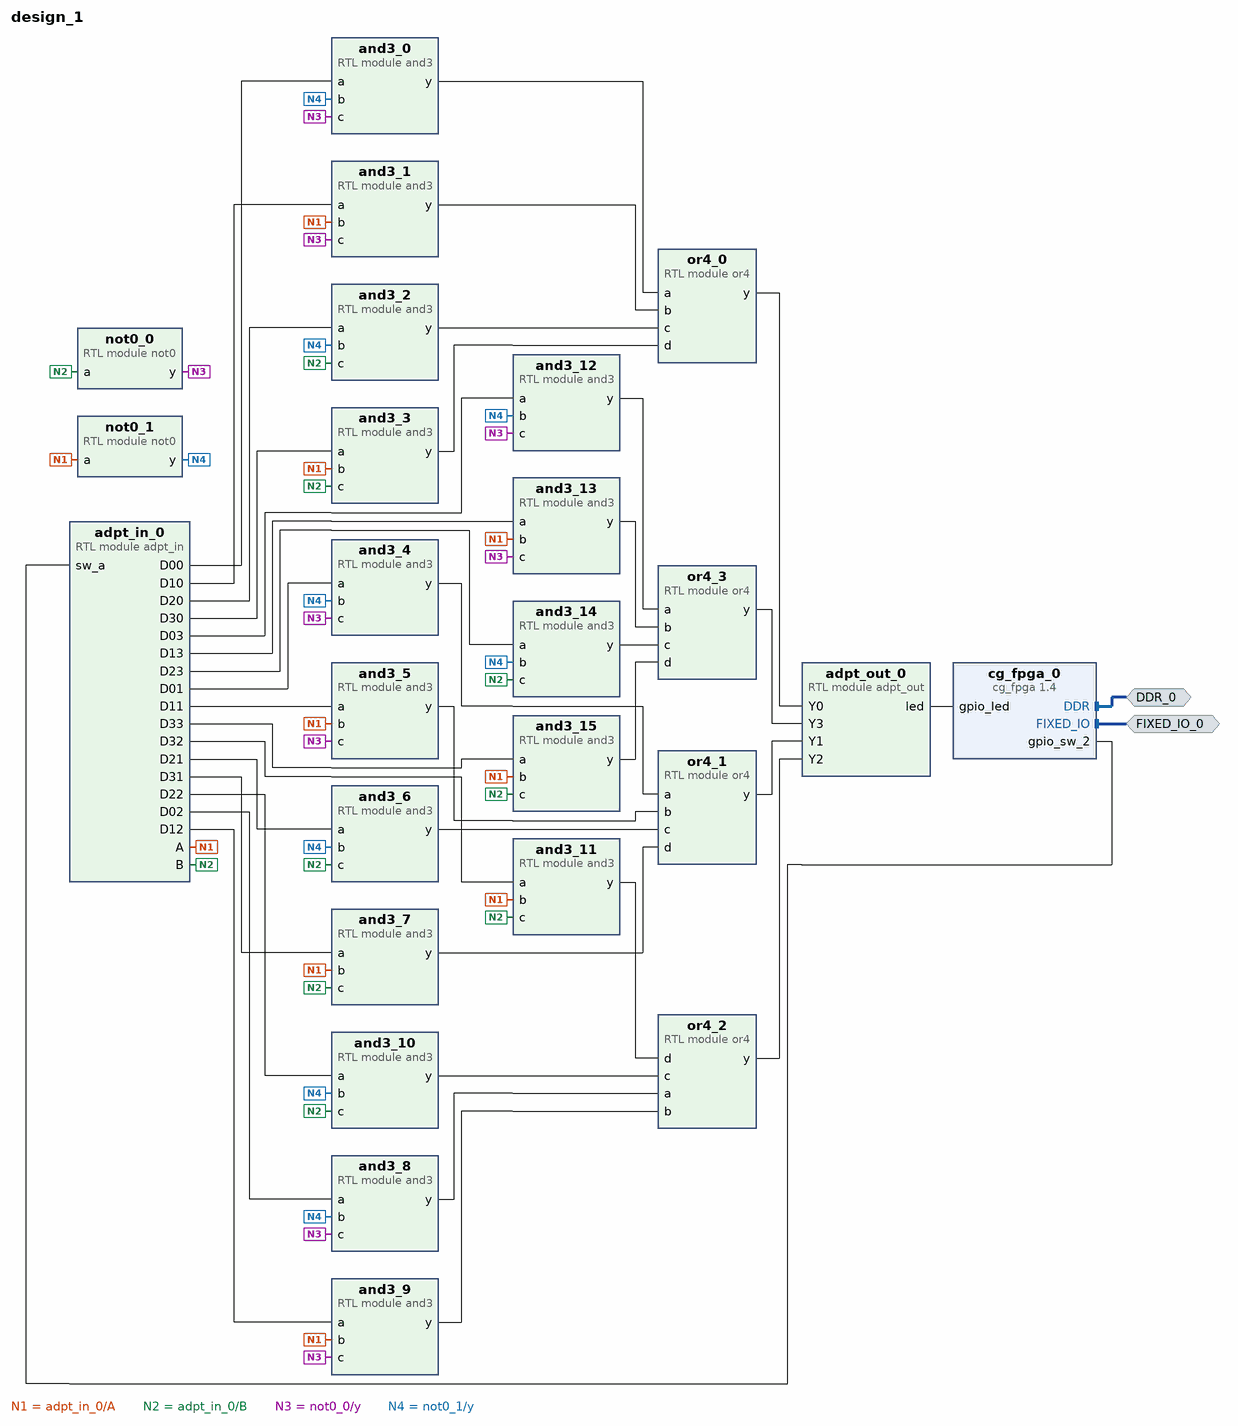
[diagram p0: block diagram of the top level]
# Vivado block design design_1, xc7z020clg400-1, Vivado 2024.2
create_bd_design design_1

create_bd_intf_port -mode Master -vlnv xilinx.com:display_processing_system7:fixedio_rtl:1.0 FIXED_IO_0
create_bd_intf_port -mode Master -vlnv xilinx.com:interface:ddrx_rtl:1.0 DDR_0

create_bd_cell -type ip -vlnv educg.net:user:cg_fpga:1.4 cg_fpga_0
create_bd_cell -type module -reference adpt_in adpt_in_0
create_bd_cell -type module -reference adpt_out adpt_out_0
create_bd_cell -type module -reference not0 not0_0
create_bd_cell -type module -reference and3 and3_0
create_bd_cell -type module -reference not0 not0_1
create_bd_cell -type module -reference and3 and3_1
create_bd_cell -type module -reference or4 or4_0
create_bd_cell -type module -reference and3 and3_2
create_bd_cell -type module -reference and3 and3_3
create_bd_cell -type module -reference and3 and3_4
create_bd_cell -type module -reference and3 and3_5
create_bd_cell -type module -reference and3 and3_6
create_bd_cell -type module -reference and3 and3_7
create_bd_cell -type module -reference or4 or4_1
create_bd_cell -type module -reference or4 or4_2
create_bd_cell -type module -reference and3 and3_8
create_bd_cell -type module -reference and3 and3_9
create_bd_cell -type module -reference and3 and3_10
create_bd_cell -type module -reference and3 and3_11
create_bd_cell -type module -reference or4 or4_3
create_bd_cell -type module -reference and3 and3_12
create_bd_cell -type module -reference and3 and3_13
create_bd_cell -type module -reference and3 and3_14
create_bd_cell -type module -reference and3 and3_15

# ---- connections ----

connect_bd_intf_net [get_bd_intf_ports DDR_0] [get_bd_intf_pins cg_fpga_0/DDR]
connect_bd_intf_net [get_bd_intf_ports FIXED_IO_0] [get_bd_intf_pins cg_fpga_0/FIXED_IO]
connect_bd_net [get_bd_pins adpt_in_0/A] \
  [get_bd_pins not0_1/a] [get_bd_pins and3_1/b] [get_bd_pins and3_3/b] [get_bd_pins and3_5/b] [get_bd_pins and3_7/b] \
  [get_bd_pins and3_9/b] [get_bd_pins and3_11/b] [get_bd_pins and3_13/b] [get_bd_pins and3_15/b]
connect_bd_net [get_bd_pins adpt_in_0/B] \
  [get_bd_pins not0_0/a] [get_bd_pins and3_2/c] [get_bd_pins and3_3/c] [get_bd_pins and3_6/c] [get_bd_pins and3_7/c] \
  [get_bd_pins and3_10/c] [get_bd_pins and3_11/c] [get_bd_pins and3_14/c] [get_bd_pins and3_15/c]
connect_bd_net [get_bd_pins adpt_in_0/D00] [get_bd_pins and3_0/a]
connect_bd_net [get_bd_pins adpt_in_0/D01] [get_bd_pins and3_4/a]
connect_bd_net [get_bd_pins adpt_in_0/D02] [get_bd_pins and3_8/a]
connect_bd_net [get_bd_pins adpt_in_0/D03] [get_bd_pins and3_12/a]
connect_bd_net [get_bd_pins adpt_in_0/D10] [get_bd_pins and3_1/a]
connect_bd_net [get_bd_pins adpt_in_0/D11] [get_bd_pins and3_5/a]
connect_bd_net [get_bd_pins adpt_in_0/D12] [get_bd_pins and3_9/a]
connect_bd_net [get_bd_pins adpt_in_0/D13] [get_bd_pins and3_13/a]
connect_bd_net [get_bd_pins adpt_in_0/D20] [get_bd_pins and3_2/a]
connect_bd_net [get_bd_pins adpt_in_0/D21] [get_bd_pins and3_6/a]
connect_bd_net [get_bd_pins adpt_in_0/D22] [get_bd_pins and3_10/a]
connect_bd_net [get_bd_pins adpt_in_0/D23] [get_bd_pins and3_14/a]
connect_bd_net [get_bd_pins adpt_in_0/D30] [get_bd_pins and3_3/a]
connect_bd_net [get_bd_pins adpt_in_0/D31] [get_bd_pins and3_7/a]
connect_bd_net [get_bd_pins adpt_in_0/D32] [get_bd_pins and3_11/a]
connect_bd_net [get_bd_pins adpt_in_0/D33] [get_bd_pins and3_15/a]
connect_bd_net [get_bd_pins adpt_out_0/led] [get_bd_pins cg_fpga_0/gpio_led]
connect_bd_net [get_bd_pins and3_0/y] [get_bd_pins or4_0/a]
connect_bd_net [get_bd_pins and3_10/y] [get_bd_pins or4_2/c]
connect_bd_net [get_bd_pins and3_11/y] [get_bd_pins or4_2/d]
connect_bd_net [get_bd_pins and3_12/y] [get_bd_pins or4_3/a]
connect_bd_net [get_bd_pins and3_13/y] [get_bd_pins or4_3/b]
connect_bd_net [get_bd_pins and3_14/y] [get_bd_pins or4_3/c]
connect_bd_net [get_bd_pins and3_15/y] [get_bd_pins or4_3/d]
connect_bd_net [get_bd_pins and3_1/y] [get_bd_pins or4_0/b]
connect_bd_net [get_bd_pins and3_2/y] [get_bd_pins or4_0/c]
connect_bd_net [get_bd_pins and3_3/y] [get_bd_pins or4_0/d]
connect_bd_net [get_bd_pins and3_4/y] [get_bd_pins or4_1/a]
connect_bd_net [get_bd_pins and3_5/y] [get_bd_pins or4_1/b]
connect_bd_net [get_bd_pins and3_6/y] [get_bd_pins or4_1/c]
connect_bd_net [get_bd_pins and3_7/y] [get_bd_pins or4_1/d]
connect_bd_net [get_bd_pins and3_8/y] [get_bd_pins or4_2/a]
connect_bd_net [get_bd_pins and3_9/y] [get_bd_pins or4_2/b]
connect_bd_net [get_bd_pins cg_fpga_0/gpio_sw_2] [get_bd_pins adpt_in_0/sw_a]
connect_bd_net [get_bd_pins not0_0/y] \
  [get_bd_pins and3_0/c] [get_bd_pins and3_1/c] [get_bd_pins and3_4/c] [get_bd_pins and3_5/c] [get_bd_pins and3_8/c] \
  [get_bd_pins and3_9/c] [get_bd_pins and3_12/c] [get_bd_pins and3_13/c]
connect_bd_net [get_bd_pins not0_1/y] \
  [get_bd_pins and3_0/b] [get_bd_pins and3_2/b] [get_bd_pins and3_4/b] [get_bd_pins and3_6/b] [get_bd_pins and3_8/b] \
  [get_bd_pins and3_10/b] [get_bd_pins and3_12/b] [get_bd_pins and3_14/b]
connect_bd_net [get_bd_pins or4_0/y] [get_bd_pins adpt_out_0/Y0]
connect_bd_net [get_bd_pins or4_1/y] [get_bd_pins adpt_out_0/Y1]
connect_bd_net [get_bd_pins or4_2/y] [get_bd_pins adpt_out_0/Y2]
connect_bd_net [get_bd_pins or4_3/y] [get_bd_pins adpt_out_0/Y3]

validate_bd_design
save_bd_design
